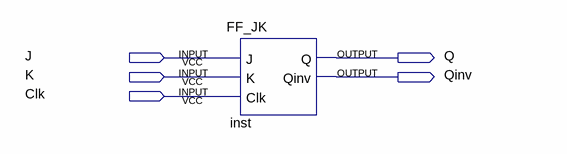
[diagram p0: schematic sheet]
// Quartus schematic L0703.bdf as structural Verilog: 1 symbols, 5 pins
module L0703 (
  input  J,
  input  K,
  input  Clk,
  output Q,
  output Qinv
);

  FF_JK inst (.J(J), .K(K), .Clk(Clk), .Q(Q), .Qinv(Qinv));
endmodule
